# EAGLE design BluetoothExpansion (EAGLE 6.4)
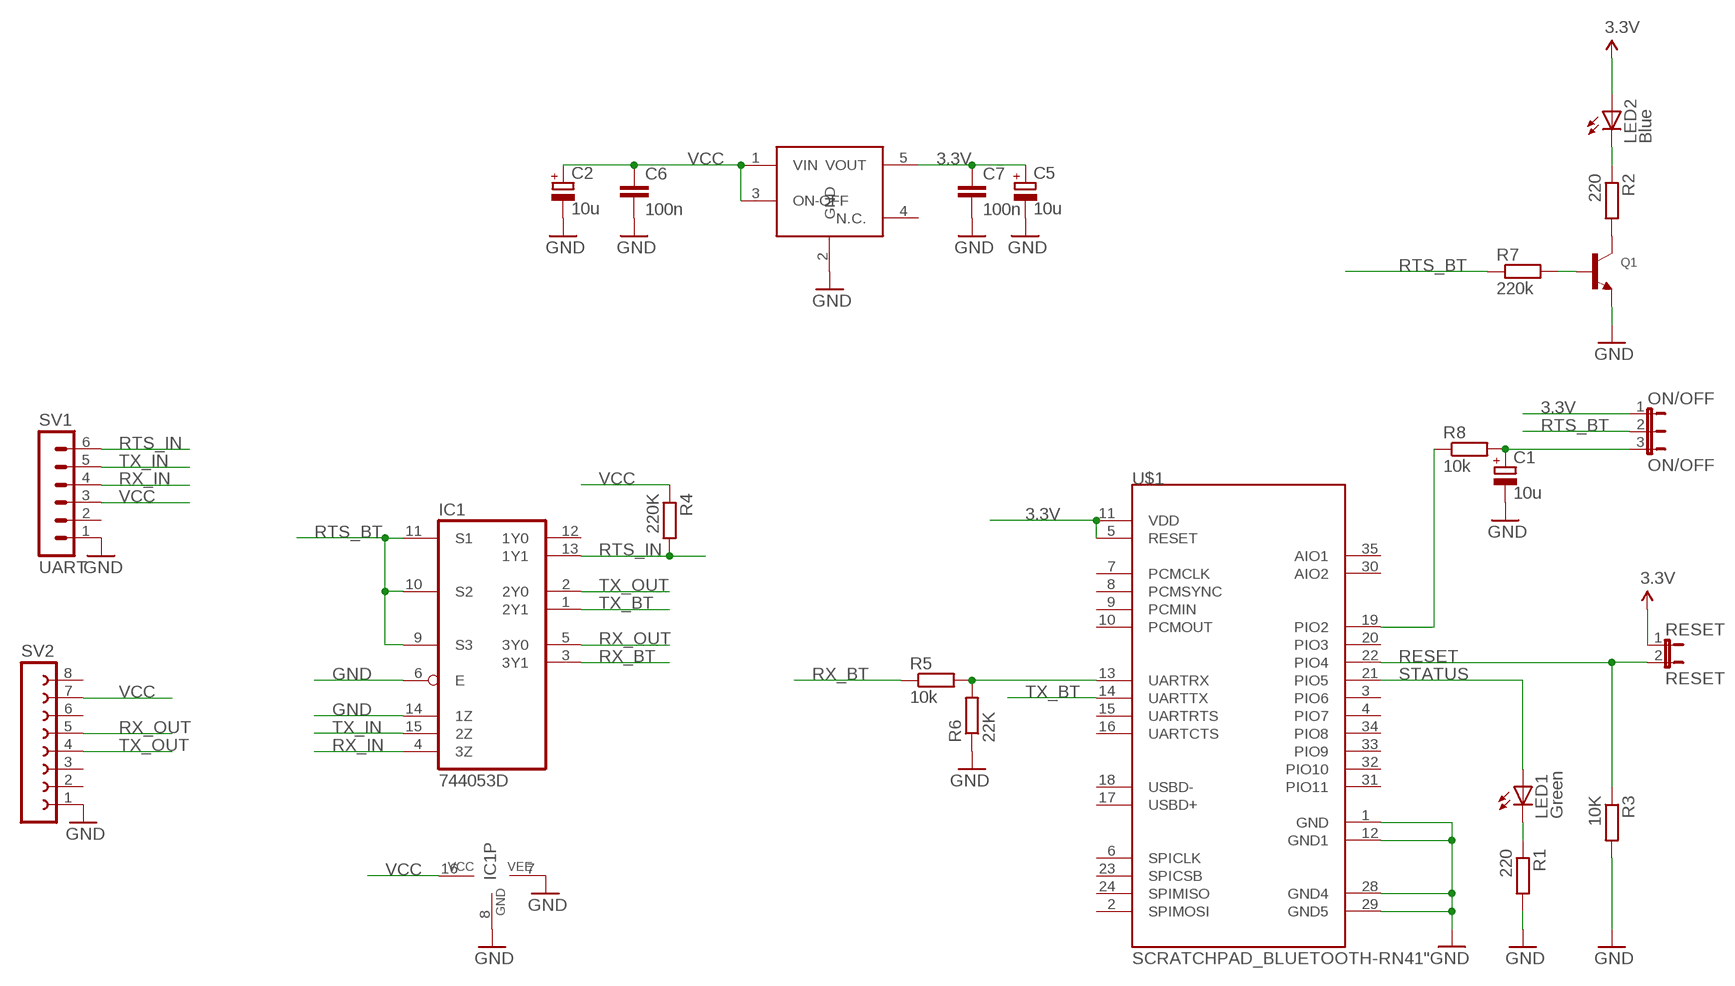
[diagram p0: schematic, sheet 1]

## Parts
C1  10u  CPOL-EUA/3216-18W  [A/3216-18W]
C2  10u  CPOL-EUA/3216-18W  [A/3216-18W]
C5  10u  CPOL-EUA/3216-18W  [A/3216-18W]
C6  100n  C-EUC0805  [C0805]
C7  100n  C-EUC0805  [C0805]
IC1  744053D  [SO16]
LED1  Green  LED3MM  [LED3MM]
LED2  Blue  LED3MM  [LED3MM]
ON/OFF  ON/OFF  JP2E  [JP2]
Q1  TRANSISTOR_NPN  [SOT23-R]
R1  220  R-EU_R0805  [R0805]
R2  220  R-EU_R0805  [R0805]
R3  10K  R-EU_R0805  [R0805]
R4  220K  R-EU_R0805  [R0805]
R5  10k  R-EU_R0805  [R0805]
R6  22K  R-EU_R0805  [R0805]
R7  220k  R-EU_R0805  [R0805]
R8  10k  R-EU_R0805  [R0805]
RESET  RESET  JP1E  [JP1]
SV1  UART  MA06-1  [MA06-1]
SV2  FE08-1  [FE08]
U2  LP2985  [SOT23-5]
U$1  SCRATCHPAD_BLUETOOTH-RN41"  [SCRATCHPAD_RN41]

## Nets
3.3V: C5.+ C7.1 ON/OFF.1 U2.5(VOUT) U$1.5(RESET) U$1.11(VDD)
GND: C1.- C2.- C5.- C6.2 C7.2 IC1.6(E) IC1.7(VEE) IC1.8(GND) IC1.14(1Z) Q1.2(E) R1.2 R3.2 R6.1 SV1.1 SV2.1 U2.2(GND) U$1.1(GND) U$1.12(GND1) U$1.28(GND4) U$1.29(GND5)
N$1: R5.2 R6.2 U$1.13(UARTRX)
N$2: R8.1 U$1.19(PIO2)
N$3: LED1.K(C) R1.1
N$4: LED2.K(C) R2.1
N$5: Q1.3(C) R2.2
N$6: C1.+ ON/OFF.3 R8.2
N$7: Q1.1(B) R7.2
RESET: R3.1 RESET.2 U$1.22(PIO4)
RTS_BT: IC1.9(S3) IC1.10(S2) IC1.11(S1) ON/OFF.2 R7.1
RTS_IN: IC1.13(1Y1) R4.2 SV1.6
RX_BT: IC1.3(3Y1) R5.1
RX_IN: IC1.4(3Z) SV1.4
RX_OUT: IC1.5(3Y0) SV2.5
STATUS: LED1.A U$1.21(PIO5)
TX_BT: IC1.1(2Y1) U$1.14(UARTTX)
TX_IN: IC1.15(2Z) SV1.5
TX_OUT: IC1.2(2Y0) SV2.4
VCC: C2.+ C6.1 IC1.16(VCC) LED2.A R4.1 RESET.1 SV1.3 SV2.7 U2.1(VIN) U2.3(ON-OFF) ; supply symbol labelled 3.3V
Unconnected: IC1.12(1Y0) SV1.2 SV2.2 SV2.3 SV2.6 SV2.8 U2.4(N.C.) U$1.2(SPIMOSI) U$1.3(PIO6) U$1.4(PIO7) U$1.6(SPICLK) U$1.7(PCMCLK) U$1.8(PCMSYNC) U$1.9(PCMIN) U$1.10(PCMOUT) U$1.15(UARTRTS) U$1.16(UARTCTS) U$1.17(USBD+) U$1.18(USBD-) U$1.20(PIO3) U$1.23(SPICSB) U$1.24(SPIMISO) U$1.30(AIO2) U$1.31(PIO11) U$1.32(PIO10) U$1.33(PIO9) U$1.34(PIO8) U$1.35(AIO1)

## Library data of the parts
C1 C2 C5 = rcl:CPOL-EU: POLARIZED CAPACITOR, European symbol
C6 C7 = rcl:C-EU: CAPACITOR, European symbol
IC1 = 74xx-eu:74*4053: Triple 2-channel analog multiplexer/demultiplexer Philips Semiconductor
LED1 LED2 = led:LED: LED OSRAM: - CHIPLED LG R971, LG N971, LY N971, LG Q971, LY Q971, LO R971, LY R971 LH N974, LH R974 LS Q976, LO Q976, LY Q976 LO Q996 - Hyper CHIPLED LW Q18S LB Q993, LB Q99A, LB R99A - SideLED LS A670, LO A670, LY A670, LG A670, LP A670 LB A673, LV A673, LT A673, LW A673 LH A674 LY A675 LS A676, LA A676, LO A676, LY A676, LW A676 LS A679, LY A679, LG A679 - Hyper Micro SIDELED® LS Y876, LA Y876, LO Y876, LY Y876 LT Y87S - SmartLED LW L88C, LW L88S LB L89C, LB L89S, LG L890 LS L89K, LO L89K, LY L89K LS L896, LA L896, LO L896, LY L896 - TOPLED LS T670, LO T670, LY T670, LG T670, LP T670 LSG T670, LSP T670, LSY T670, LOP T670, LYG T670 LG T671, LOG T671, LSG T671 LB T673, LV T673, LT T673, LW T673 LH T674 LS T676, LA T676, LO T676, LY T676, LB T676, LH T676, LSB T676, LW T676 LB T67C, LV T67C, LT T67C, LS T67K, LO T67K, LY T67K, LW E67C LS E67B, LA E67B, LO E67B, LY E67B, LB E67C, LV E67C, LT E67C LW T67C LS T679, LY T679, LG T679 LS T770, LO T770, LY T770, LG T770, LP T770 LB T773, LV T773, LT T773, LW T773 LH T774 LS E675, LA E675, LY E675, LS T675 LS T776, LA T776, LO T776, LY T776, LB T776 LHGB T686 LT T68C, LB T68C - Hyper Mini TOPLED® LB M676 - Mini TOPLED Santana® LG M470 LS M47K, LO M47K, LY M47K Source: http://www.osram.convergy.de LUXEON: - LUMILED® LXK2-PW12-R00, LXK2-PW12-S00, LXK2-PW14-U00, LXK2-PW14-V00 LXK2-PM12-R00, LXK2-PM12-S00, LXK2-PM14-U00 LXK2-PE12-Q00, LXK2-PE12-R00, LXK2-PE12-S00, LXK2-PE14-T00, LXK2-PE14-U00 LXK2-PB12-K00, LXK2-PB12-L00, LXK2-PB12-M00, LXK2-PB14-N00, LXK2-PB14-P00, LXK2-PB14-Q00 LXK2-PR12-L00, LXK2-PR12-M00, LXK2-PR14-Q00, LXK2-PR14-R00 LXK2-PD12-Q00, LXK2-PD12-R00, LXK2-PD12-S00 LXK2-PH12-R00, LXK2-PH12-S00 LXK2-PL12-P00, LXK2-PL12-Q00, LXK2-PL12-R00 Source: www.luxeon.com KINGBRIGHT: KA-3528ASYC Source: www.kingbright.com
ON/OFF = jumper:JP2E: JUMPER
Q1 = microbuilder:TRANSISTOR_NPN: NPN Transistor Transistor (NPN) 500mA 45V - BC817 [Digikey: 568-1631-1-ND] Transistor (NPN) 500mA 45V - BC817,215 [Mouser: 771-BC817-T/R] SOT23-R - SOT23 footprint optimised for use with solder paste and reflow ovens. SOT23-W - SOT23 footprint optimised for hand-soldering (larger pads).
R1-R8 = rcl:R-EU_: RESISTOR, European symbol
RESET = jumper:JP1E: JUMPER
SV1 = con-lstb:MA06-1: PIN HEADER
SV2 = con-lsta:FE08-1: FEMALE HEADER
U2 = LP2985:LP2985
U$1 = BluetoothExpansion:SCRATCHPAD_BLUETOOTH-RN41

## Net classes
0 default: width 0.254 mm, drill 0.254 mm, clearance 0.254 mm

## Board
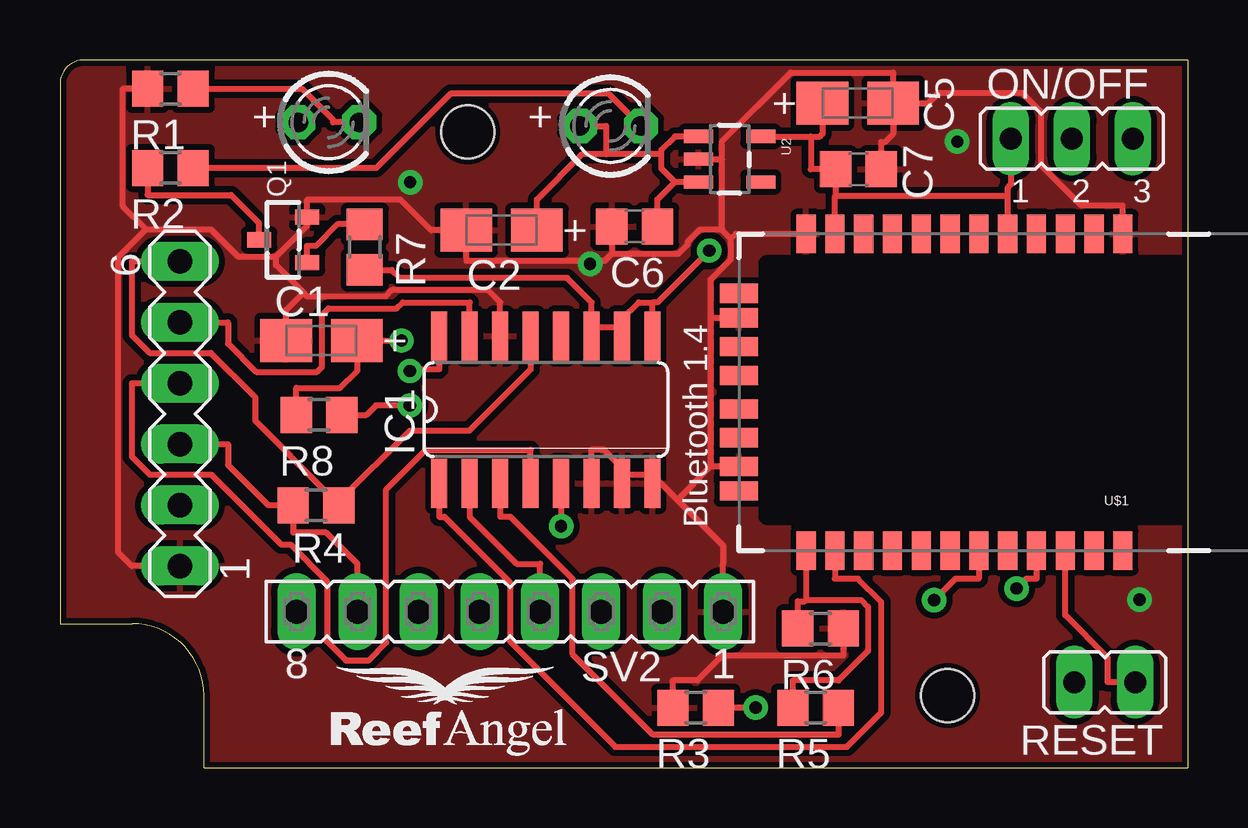
[diagram p1: board, top side]
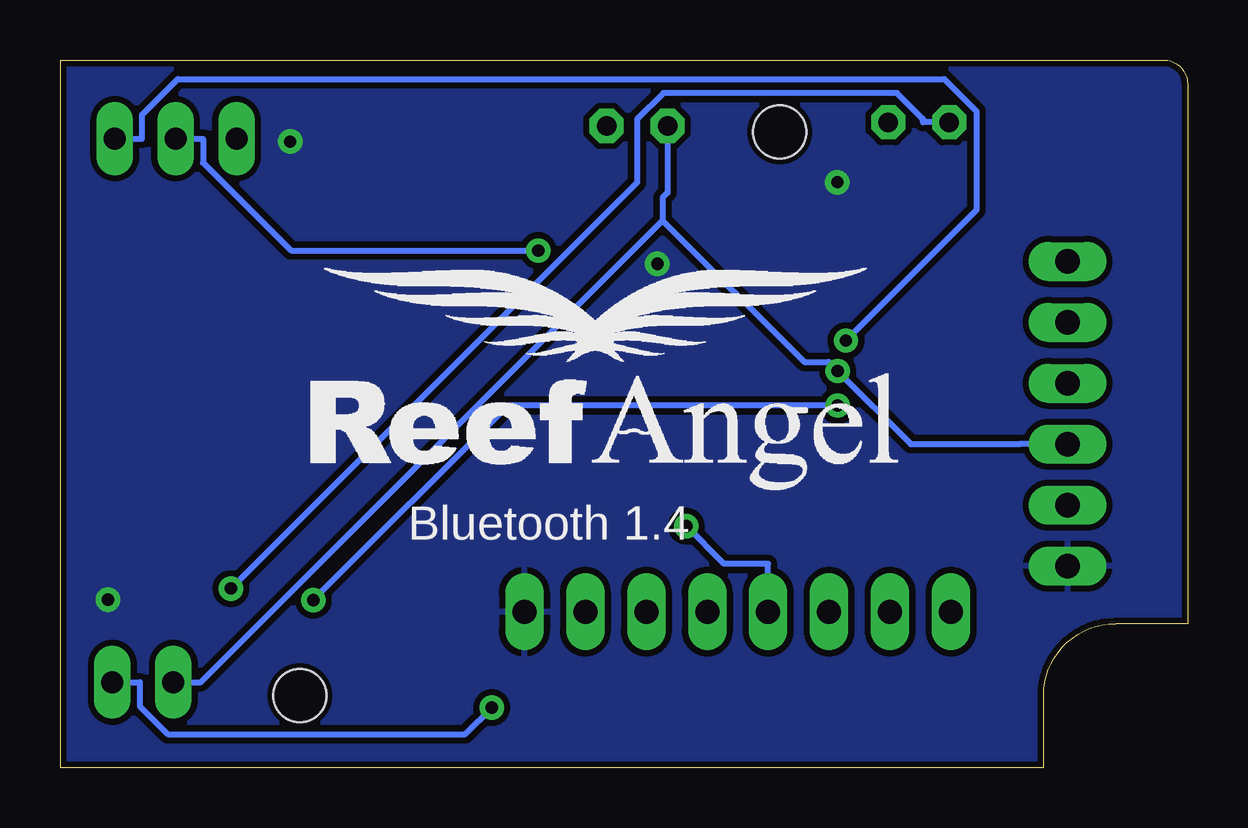
[diagram p2: board, bottom side, seen from below]

Size 47 x 29.5 mm. Coordinates in mm from the lower left corner, seen from the top.
Outline: 6,0 47,0 47,29.5 1,29.5 arc90 0,28.5 0,6 3,6 arc-90 6,3 6,0
Copper layers (1*16): Top 0.035mm / dielectric 1.5mm / Bottom 0.035mm
Design rules "default": minimum track width 8mil, minimum drill 20mil, track to track 8mil, track to pad 8mil, pad to pad 8mil, via to via 8mil, smd to smd 8mil, copper to edge 9mil, drill to drill 8mil, minimum pad ring 12mil, minimum via ring 10mil, stop-mask expansion 4mil, vias tented up to drill 20mil, thermal gap 10mil
Holes 2.2 mm at 17,26.5 37,3
tKeepout: area 29.5,10.5 to 48,21
tRestrict: area 29.5,10.5 to 48,21

### Footprints (pad centres in the part's own frame; a part is rotated, then mirrored left to right if it is on the bottom)
A/3216-18W = smd 2.15 x 1.8: + 1.475,0; - -1.475,0
C0805 = smd 1.3 x 1.5: 1 -0.95,0; 2 0.95,0
SO16 = smd 0.66 x 2.032: 1 -4.445,-3.073; 2 -3.175,-3.073; 3 -1.905,-3.073; 4 -0.635,-3.073; 5 0.635,-3.073; 6 1.905,-3.073; 7 3.175,-3.073; 8 4.445,-3.073; 9 4.445,3.073; 10 3.175,3.073; 11 1.905,3.073; 12 0.635,3.073; 13 -0.635,3.073; 14 -1.905,3.073; 15 -3.175,3.073; 16 -4.445,3.073
LED3MM = drill 0.813 octagon: A -1.27,0; K 1.27,0
JP2 = drill 0.914 long: 1 -2.54,0; 2 0,0; 3 2.54,0
SOT23-R = smd 0.635 x 1.016: 1 -0.95,-1; 2 0.95,-1; 3 0,1
R0805 = smd 1.3 x 1.5: 1 -0.95,0; 2 0.95,0
JP1 = drill 0.914 long: 1 0,-1.27; 2 0,1.27
MA06-1 = drill 1.016 long: 1 -6.35,0; 2 -3.81,0; 3 -1.27,0; 4 1.27,0; 5 3.81,0; 6 6.35,0
FE08 = drill 1 long: 1 -8.89,0; 2 -6.35,0; 3 -3.81,0; 4 -1.27,0; 5 1.27,0; 6 3.81,0; 7 6.35,0; 8 8.89,0
SOT23-5 = smd 0.55 x 1.2: 1 -0.95,-1.3; 2 0,-1.3; 3 0.95,-1.3; 4 0.95,1.3; 5 -0.95,1.3
SCRATCHPAD_RN41 = smd 0.8 x 1.6: 1 -6.6,-6.6; 2 -5.4,-6.6; 3 -4.2,-6.6; 4 -3,-6.6; 5 -1.8,-6.6; 6 -0.6,-6.6; 7 0.6,-6.6; 8 1.8,-6.6; 9 3,-6.6; 10 4.2,-6.6; 11 5.4,-6.6; 12 6.6,-6.6; 13 6.6,6.6; 14 5.4,6.6; 15 4.2,6.6; 16 3,6.6; 17 1.8,6.6; 18 0.6,6.6; 19 -0.6,6.6; 20 -1.8,6.6; 21 -3,6.6; 22 -4.2,6.6; 23 -5.4,6.6; 24 -6.6,6.6 | smd 1.6 x 0.8: 28 9.4,3.1; 29 9.4,-3.1; 30 9.4,-4.122; 31 9.4,-1.9; 32 9.4,-0.7; 33 9.4,0.7; 34 9.4,1.9; 35 9.4,4.122

### Placement (x,y rotation side)
C1  10.9,17.8 0 top
C2  18.41,22.4 0 top
C5  33.26,27.7 180 top
C6  23.95,22.56 180 top
C7  33.28,24.94 0 top
IC1  20.25,14.92 0 top
LED1  11.2,26.9 0 top
LED2  22.95,26.75 0 top
ON/OFF  42.18,26.22 0 top
Q1  9.3,22 90 top
R1  4.6,28.3 180 top
R2  4.6,25 180 top
R3  26.5,2.5 180 top
R4  10.67,10.93 0 top
R5  31.5,2.5 180 top
R6  31.7,5.8 180 top
R7  12.7,21.7 90 top
R8  10.8,14.7 180 top
RESET  43.55,3.56 270 top
SV1  5,14.75 90 top
SV2  18.75,6.5 180 top
U2  27.91,25.36 270 top
U$1  37.7,15.65 180 top

### Tracks (layer width: path | path; a pad name or v marks a point on that pad's centre or on a via)
3.3V
  Top 0.254: 31.3,26.31 31.68,26.31 31.78,26.42 C5.+ | 31.3,26.31 29.7,26.31 U2.5 | 31.3,26.31 31.3,24.94 C7.1 32.33,23.81 | 39.5,23.81 39.5,24.18 39.64,24.31 ON/OFF.1 | U$1.5 39.5,23.81 | 39.5,23.81 32.33,23.81 | U$1.11 32.3,23.78 32.33,23.81
GND  (via drill 0.51 pad 1.02)
  Top 0.254: C5.- 34.73,28.98 30.47,28.98 27.59,26.11 27.59,25.36 | 27.56,22.44 27.59,22.48 27.59,25.36 | 27.56,22.44 27.95,22.05 | 23,21.43 25.78,21.43 26.17,21.82 26.17,21.92 26.7,22.44 27.56,22.44 | U2.2 27.59,25.36 | 25.73,11.16 27.64,9.26 27.64,8.49 SV2.1 27.64,4.72 27.64,4.69 | 24.7,12.2 25.73,11.16 | 27.12,12.55 25.73,11.16 | 27.12,18.75 27.12,12.55 | 10.15,19.8 9.01,20.95 9.01,21.29 | 10.15,19.8 10.31,19.64 13.58,19.64 13.83,19.9 17.84,19.9 18.35,19.39 IC1.14 | 10.15,19.8 9.43,19.08 C1.- | U$1.28 27.12,12.55 | 27.95,22.05 27.95,21.18 27.12,20.35 27.12,18.75 | U$1.12 28.16,22.25 27.95,22.05 | SV1.1 2.99,8.4 2.43,8.97 2.43,21.28 3.59,22.45 | 3.59,22.45 6.29,22.45 7.44,21.29 9.01,21.29 | 3.59,22.45 2.62,23.42 2.62,28.3 R1.2 | R3.2 25.55,3.63 26.58,3.63 27.64,4.69 | 27.64,4.69 27.66,4.67 32.65,4.67 R6.1 | 23,21.43 22.7,21.12 16.93,21.12 C2.- 15.48,22.4 14.2,23.68 10.33,23.68 10.3,23.65 Q1.2 10.3,22.59 9.01,21.29 | 23.6,12.2 23.6,12.33 22.69,13.24 22.16,13.24 IC1.6 | IC1.7 23.6,12.02 23.6,12.2 | 24.7,12.2 23.6,12.2 | U$1.29 27.12,18.75 | IC1.8 24.7,12.2 | C6.2 23,21.43 | C5.- 36.19,27.7 36.62,28.12 40.11,28.12 40.91,27.33 40.91,25.1 42.58,23.43 44.3,23.43 U$1.1 | C7.2 34.23,26.07 34.39,26.07 34.73,26.42 C5.-
  other vias: 45,7 14.6,24.4 37.4,26.1 22.1,21
  pour Bottom (isolate 0.254): 0,0 0,30 47,30 47,0
  pour Top (isolate 0.254): 0,0 0,30 47,30 47,0
N$1
  Top 0.254: R6.2 30.75,6.93 31.05,6.93 31.1,6.98 | 31.1,6.98 33.4,6.98 33.68,6.71 33.68,4.86 32.46,3.63 30.55,3.63 R5.2 | 31.1,6.98 31.1,7.87 U$1.13
N$2  (via drill 0.51 pad 1.02)
  Top 0.254: v36.44,6.98 37.33,7.87 38.3,7.87 U$1.19 | R8.1 12.78,14.7 13.18,15.09 v14.59,15.09
  Bottom 0.254: v14.59,15.09 28.33,15.09 v36.44,6.98
N$3
  Top 0.254: LED1.K 11.38,26.9 11.38,27.01 10.09,28.3 R1.1
N$4
  Top 0.254: LED2.K 22.87,28.09 16.27,28.09 13.18,25 R2.1
N$5
  Top 0.254: Q1.3 8.3,22.7 7.13,23.87 3.65,23.87 R2.2
N$6  (via drill 0.51 pad 1.02)
  Top 0.254: v14.24,17.8 13.83,17.8 C1.+ 12.38,16.52 11.69,15.83 9.85,15.83 R8.2
  Bottom 0.254: v14.24,17.8 8.79,23.24 8.79,27.36 10.14,28.7 42.09,28.7 43.58,27.22 43.58,26.22 ON/OFF.3
N$7
  Top 0.254: Q1.1 10.3,21.75 10.67,21.75 11.57,22.65 R7.2
RESET  (via drill 0.51 pad 1.02)
  Top 0.254: v29,2.5 R3.1 | U$1.22 41.9,6.36 43.67,4.58 43.67,3.56 RESET.2
  Bottom 0.254: RESET.2 43.67,3.56 43.67,2.56 42.51,1.39 30.11,1.39 v29,2.5
RTS_BT  (via drill 0.51 pad 1.02)
  Top 0.254: 23.43,18.34 23.43,18.69 24.13,19.39 24.7,19.39 | IC1.10 23.43,18.34 | 22.16,18.34 22.16,19.39 21.14,20.41 14.17,20.41 13.83,20.75 R7.1 | IC1.11 22.16,18.34 | 23.43,18.34 22.16,18.34 | v27.06,21.55 24.9,19.39 24.7,19.39 | IC1.9 24.7,19.39
  Bottom 0.254: ON/OFF.2 41.03,26.22 41.03,25.22 37.37,21.55 v27.06,21.55
RTS_IN
  Top 0.254: IC1.13 19.62,16.6 17.07,14.05 14.59,14.05 11.62,11.08 | 11.62,11.08 11.62,11.5 11.1,11.5 8.14,14.46 8.14,15.44 6.29,17.29 3.74,17.29 2.99,18.04 2.99,21.1 SV1.6 | R4.2 11.62,11.08
RX_BT
  Top 0.254: IC1.3 18.35,10.45 18.78,10.45 21.37,7.86 21.37,4.72 24.72,1.37 32.45,1.37 R5.1
RX_IN
  Top 0.254: IC1.4 19.62,13.24 15.25,13.24 13.6,11.6 13.6,5.21 12.86,4.46 11.92,4.46 11.13,5.25 11.13,7.77 9.61,9.29 9.22,9.29 6.31,12.21 3.74,12.21 2.99,12.96 2.99,16.02 SV1.4
RX_OUT  (via drill 0.51 pad 1.02)
  Top 0.254: v20.89,10.06 20.89,10.45 IC1.5
  Bottom 0.254: v20.89,10.06 19.32,8.49 17.48,8.49 SV2.5
STATUS  (via drill 0.51 pad 1.02)
  Top 0.254: U$1.21 40.7,7.87 40.28,7.87 v39.87,7.46
  Bottom 0.254: LED1.A 11.02,26.9 11.02,27.04 12.11,28.12 21.85,28.12 22.95,27.03 22.95,24.39 v39.87,7.46
TX_BT
  Top 0.254: U$1.14 32.3,7.87 33.27,7.87 34.23,6.9 34.23,2.3 32.79,0.86 23.15,0.86 18.75,5.26 18.75,7.73 16.03,10.45 15.81,10.45 IC1.1
TX_IN
  Top 0.254: IC1.15 17.08,19.39 14.3,19.39 14.04,19.14 11.2,19.14 10.92,18.86 10.92,16.7 10.71,16.5 8.18,16.5 7.01,17.67 7.01,18.56 SV1.5
TX_OUT
  Top 0.254: IC1.2 17.08,10.45 19.04,8.49 20.02,8.49 SV2.4
VCC  (via drill 0.51 pad 1.02)
  Top 0.254: v14.59,16.53 14.65,16.6 15.81,16.6 IC1.16 | SV2.7 12.4,8.49 11.09,9.8 9.72,9.8 R4.1 8.69,10.93 7.01,12.62 7.01,13.48 SV1.3 | 25.06,25.57 25.06,24.98 25.63,24.41 | 25.06,25.57 25.06,25.74 25.63,26.31 U2.1 | 25.06,25.57 22.77,25.57 | 22.77,25.57 21.77,25.57 19.88,23.68 C2.+ | 22.77,25.57 22.77,26.75 LED2.A | C6.1 24.9,23.69 24.91,23.69 25.63,24.41 | U2.3 25.63,24.41
  Bottom 0.254: 21.88,22.81 15.98,16.91 14.97,16.91 v14.59,16.53 11.54,13.48 7.01,13.48 SV1.3 | 21.88,22.81 41.13,3.56 RESET.1 | 21.88,22.81 21.88,23.76 21.68,23.96 21.68,25.66 LED2.A

### Text on the board
tPlace: + | + | Bluetooth 1.4
bPlace: Bluetooth 1.4